# Altium schematic sheet Clock Buffer.SchDoc
size A; SheetNumber: 12; SheetTotal: 12
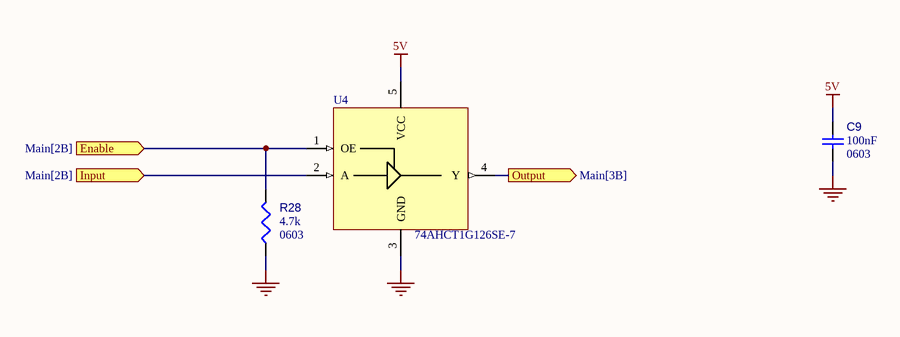
[diagram p0: Clock Buffer.SchDoc]

## Parts
C9  value 100nF  Case/Package: 0603  [CAPC1608X90X40NL10T20]  (hidden comment: Capacitor 100 nF +/-10% 50 V 0603)
R28  value 4.7k  Case/Package: 0603  [RESC1608X55X25ML10T15]  (hidden comment: Resistor 1k +/-1% 0603 100 mW)
U4  74AHCT1G126SE-7  [SOT65P210X110-5N]

## Ports
Enable (in, see Main[2B]), Input (in, see Main[2B]), Output (out, see Main[3B])

## Nets
5V: C9.2 U4.5(VCC)
GND: C9.1 R28.1 U4.3(GND)
Enable: R28.2 U4.1(OE) ; port Enable
Input: U4.2(A) ; port Input
Output: U4.4(Y) ; port Output

## Library data of the parts
C9 = CMP-001-00017-6: Chip Capacitor, 100 nF, +/- 10%, 50 V, 0603 (1608 Metric); Voltage Rating: 50V; Capacitor Type: Ceramic; Tolerance: 10%; Mounting Technology: SM; Max Operating Temperature: 125°C; RoHS Compliant: True; Pins: 2; Min Operating Temperature: -55°C
R28 = CMP-009-00014-5: Chip Resistor, 1 KOhm, +/-1%, 0.1 W, -55 to 155 degC, 0603 (1608 Metric); Voltage Rating: 50V; Power: 100mW; Tolerance: 1%; Mounting Technology: SM; Pins: 2; Min Operating Temperature: -55°C; RoHS Compliant: True; Max Operating Temperature: 155°C
U4 = CMP-018-000000-2: 74AHC Series 5.5 V Surface Mount Single Buffer Gate w/ 3-ST Output - SOT-353; MF: Diodes Inc.; Value: *; Source: SnapEDAsch.SchLib; Package: SOT-353 Diodes Inc.; Design Item ID: 74AHCT1G126SE-7; Availability: Unavailable; MP: 74AHCT1G126SE-7; DigiKey-Purchase-URL: https://snapeda.com/shop?store=DigiKey&id=139076; SnapEDA_Link: https://www.snapeda.com/parts/74AHCT1G126SE-7/Diodes%20Inc./view-part/139076/?ref=snap; Component Type: Standard; Price: None; Pin Count: 5